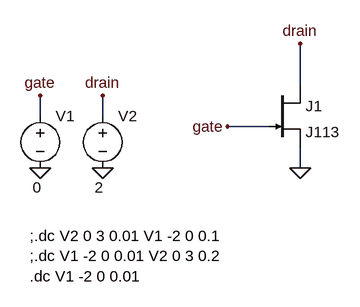
[diagram p0: schematic fig1.asc]
fig1.asc, the LTspice schematic file:
Version 4
SHEET 1 1620 680
WIRE -288 48 -288 -16
WIRE -688 96 -688 64
WIRE -592 96 -592 64
WIRE -336 112 -400 112
WIRE -288 176 -288 144
FLAG -688 64 gate
FLAG -592 176 0
FLAG -592 64 drain
FLAG -688 176 0
FLAG -400 112 gate
FLAG -288 -16 drain
FLAG -288 176 0
SYMBOL voltage -592 80 R0
WINDOW 123 0 0 Left 0
WINDOW 39 0 0 Left 0
WINDOW 3 -12 126 Left 2
SYMATTR Value 2
SYMATTR InstName V2
SYMBOL voltage -688 80 R0
WINDOW 123 0 0 Left 0
WINDOW 39 0 0 Left 0
WINDOW 3 -12 126 Left 2
SYMATTR Value 0
SYMATTR InstName V1
SYMBOL njf -336 48 R0
SYMATTR InstName J1
SYMATTR Value J113
TEXT -704 280 Left 2 !;.dc V2 0 3 0.01 V1 -2 0 0.1\n;.dc V1 -2 0 0.01 V2 0 3 0.2\n.dc V1 -2 0 0.01

The netlist it stands for:
* fig1.asc
V2 drain 0 2
V1 gate 0 0
J1 drain gate 0 J113
.model NJF NJF
.model PJF PJF
.lib standard.jft
;.dc V2 0 3 0.01 V1 -2 0 0.1
;.dc V1 -2 0 0.01 V2 0 3 0.2
.dc V1 -2 0 0.01
.backanno
.end